# EAGLE design 2020can_master_v4_x (EAGLE 9.6.2)
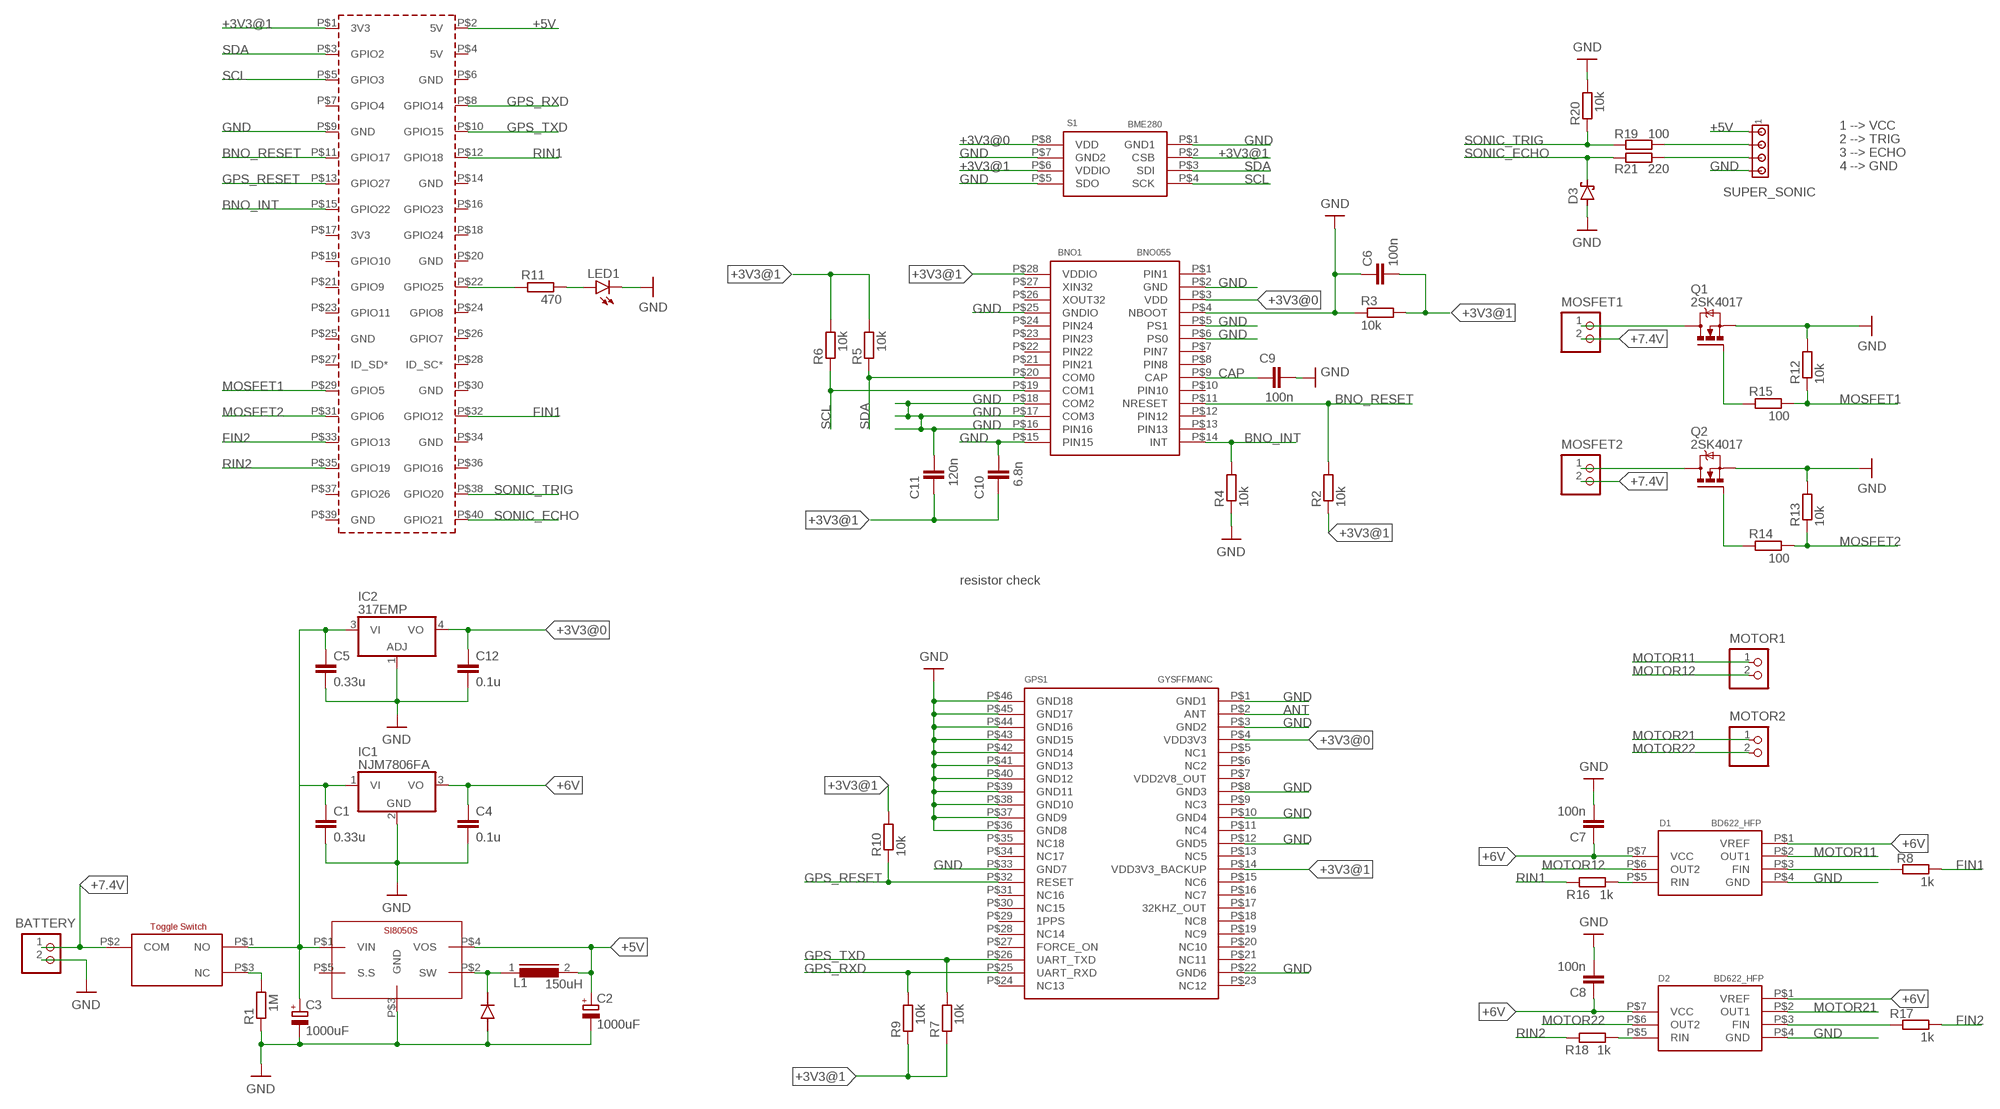
[diagram p0: schematic, sheet 1]

## Parts
BATTERY  B2P-VH  [B2P-VH]
BNO1  BNO055  [BNO055]
C1  0.33u  C5/3  [C5B3]
C2  1000uF  CPOL-EUE5-10.5  [E5-10,5]
C3  1000uF  CPOL-EUE5-10.5  [E5-10,5]
C4  0.1u  C5/3  [C5B3]
C5  0.33u  C5/3  [C5B3]
C6  100n  C-EUC1206  [C1206]
C7  100n  C-EUC1206  [C1206]
C8  100n  C-EUC1206  [C1206]
C9  100n  C-EUC1206  [C1206]
C10  6.8n  C-EUC1206  [C1206]
C11  120n  C-EUC1206  [C1206]
C12  0.1u  C5/3  [C5B3]
D1  BD622_HFP  [BD62**_HRP7]
D2  BD622_HFP  [BD62**_HRP7]
D3  15KEXXD  [DO201T15]
DIODE_1.1  DIODE_1.5  [DIODE_1.5]
GPS1  GYSFFMANC  [GYSFFMANC]
IC1  NJM7806FA  786TV  [TO220V]
IC2  317EMP  [SOT223]
L1  150uH  SFT830D  [SFT830D]
LED1  LED5MM  [LED5MM]
MOSFET1  B2P-VH  [B2P-VH]
MOSFET2  B2P-VH  [B2P-VH]
MOTOR1  B2P-VH  [B2P-VH]
MOTOR2  B2P-VH  [B2P-VH]
PCB1  RPI3RPI3  [RPI3]
Q1  2SK4017  IRF520  [TO220BV]
Q2  2SK4017  IRF520  [TO220BV]
R1  1M  R-EU_R1206  [R1206]
R2  10k  R-EU_R1206  [R1206]
R3  10k  R-EU_R1206  [R1206]
R4  10k  R-EU_R1206  [R1206]
R5  10k  R-EU_R1206  [R1206]
R6  10k  R-EU_R1206  [R1206]
R7  10k  R-EU_R1206  [R1206]
R8  1k  R-EU_R1206  [R1206]
R9  10k  R-EU_R1206  [R1206]
R10  10k  R-EU_R1206  [R1206]
R11  470  R-EU_0207/10  [0207/10]
R12  10k  R-EU_R1206  [R1206]
R13  10k  R-EU_R1206  [R1206]
R14  100  R-EU_0207/10  [0207/10]
R15  100  R-EU_0207/10  [0207/10]
R16  1k  R-EU_R1206  [R1206]
R17  1k  R-EU_R1206  [R1206]
R18  1k  R-EU_R1206  [R1206]
R19  100  R-EU_0207/10  [0207/10]
R20  10k  R-EU_R1206  [R1206]
R21  220  R-EU_0207/10  [0207/10]
S1  BME280  [BME280]
SI8050S1  SI8050S  [SI8050S]
SUPER_SONIC  MTA04-100  [10X04MTA]
SWITCH_2MS1T2B4M2QES1  SWITCH_2MS1T2B4M2QES  [SWITCH_2MS1T2B4M2QES]

## Nets
+3V3@0: BNO1.P$3(VDD) C12.1 GPS1.P$4(VDD3V3) IC2.4(VO) S1.P$8(VDD)
+3V3@1: BNO1.P$28(VDDIO) C6.2 C10.1 C11.1 GPS1.P$14(VDD3V3_BACKUP) PCB1.P$1(3V3) R2.1 R3.2 R5.2 R6.2 R7.1 R9.1 R10.2 S1.P$2(CSB) S1.P$6(VDDIO)
+5V [power]: C2.+ L1.2 PCB1.P$2(5V) SI8050S1.P$4(VOS) SUPER_SONIC.1
+6V [motor]: C4.1 C7.1 C8.1 D1.P$1(VREF) D1.P$7(VCC) D2.P$1(VREF) D2.P$7(VCC) IC1.3(VO)
+7.4V [power]: BATTERY.1 MOSFET1.2 MOSFET2.2 SWITCH_2MS1T2B4M2QES1.P$2(COM)
ANT [signal]: GPS1.P$2(ANT)
BNO_INT [signal]: BNO1.P$14(INT) PCB1.P$15(GPIO22) R4.2
BNO_RESET [signal]: BNO1.P$11(NRESET) PCB1.P$11(GPIO17) R2.2
CAP [signal]: BNO1.P$9(CAP) C9.1
FIN1 [signal]: PCB1.P$32(GPIO12) R8.1
FIN2 [signal]: PCB1.P$33(GPIO13) R17.1
GND: BATTERY.2 BNO1.P$2(GND) BNO1.P$4(NBOOT) BNO1.P$5(PS1) BNO1.P$6(PS0) BNO1.P$15(PIN15) BNO1.P$16(PIN16) BNO1.P$17(COM3) BNO1.P$18(COM2) BNO1.P$25(GNDIO) C1.2 C2.- C3.- C4.2 C5.2 C6.1 C7.2 C8.2 C9.2 C10.2 C11.2 C12.2 D1.P$4(GND) D2.P$4(GND) D3.A DIODE_1.1.P$1(ANODE) GPS1.P$1(GND1) GPS1.P$3(GND2) GPS1.P$8(GND3) GPS1.P$10(GND4) GPS1.P$12(GND5) GPS1.P$22(GND6) GPS1.P$33(GND7) GPS1.P$36(GND8) GPS1.P$37(GND9) GPS1.P$38(GND10) GPS1.P$39(GND11) GPS1.P$40(GND12) GPS1.P$41(GND13) GPS1.P$42(GND14) GPS1.P$43(GND15) GPS1.P$44(GND16) GPS1.P$45(GND17) GPS1.P$46(GND18) IC1.2(GND) IC2.1(ADJ) LED1.K(C) PCB1.P$9(GND) Q1.S Q2.S R1.1 R3.1 R4.1 R12.2 R13.2 R20.2 S1.P$1(GND1) S1.P$5(SDO) S1.P$7(GND2) SI8050S1.P$3(GND) SUPER_SONIC.4
GPS_RESET [signal]: GPS1.P$32(RESET) PCB1.P$13(GPIO27) R10.1
GPS_RXD [signal]: GPS1.P$25(UART_RXD) PCB1.P$8(GPIO14) R9.2
GPS_TXD [signal]: GPS1.P$26(UART_TXD) PCB1.P$10(GPIO15) R7.2
MOSFET1: PCB1.P$29(GPIO5) R12.1 R15.2
MOSFET2: PCB1.P$31(GPIO6) R13.1 R14.2
MOTOR11 [motor]: D1.P$2(OUT1) MOTOR1.1
MOTOR12 [motor]: D1.P$6(OUT2) MOTOR1.2
MOTOR21 [motor]: D2.P$2(OUT1) MOTOR2.1
MOTOR22 [motor]: D2.P$6(OUT2) MOTOR2.2
N$1: R1.2 SWITCH_2MS1T2B4M2QES1.P$3(NC)
N$2 [motor]: DIODE_1.1.P$2(CATHODE) L1.1 SI8050S1.P$2(SW)
N$3: PCB1.P$22(GPIO25) R11.1
N$4 [power]: C1.1 C3.+ C5.1 IC1.1(VI) IC2.3(VI) SI8050S1.P$1(VIN) SWITCH_2MS1T2B4M2QES1.P$1(NO)
N$5: LED1.A R11.2
N$6: MOSFET1.1 Q1.D
N$7: D1.P$3(FIN) R8.2
N$8: MOSFET2.1 Q2.D
N$9: D1.P$5(RIN) R16.1
N$10: Q1.G R15.1
N$11: Q2.G R14.1
N$12: D2.P$3(FIN) R17.2
N$14: D2.P$5(RIN) R18.1
N$15: R19.2 SUPER_SONIC.2
N$16: R21.2 SUPER_SONIC.3
RIN1 [signal]: PCB1.P$12(GPIO18) R16.2
RIN2 [signal]: PCB1.P$35(GPIO19) R18.2
SCL [signal]: BNO1.P$19(COM1) PCB1.P$5(GPIO3) R6.1 S1.P$4(SCK)
SDA [signal]: BNO1.P$20(COM0) PCB1.P$3(GPIO2) R5.1 S1.P$3(SDI)
SONIC_ECHO: D3.C PCB1.P$40(GPIO21) R21.1
SONIC_TRIG: PCB1.P$38(GPIO20) R19.1 R20.1
Unconnected: BNO1.P$1(PIN1) BNO1.P$7(PIN7) BNO1.P$8(PIN8) BNO1.P$10(PIN10) BNO1.P$12(PIN12) BNO1.P$13(PIN13) BNO1.P$21(PIN21) BNO1.P$22(PIN22) BNO1.P$23(PIN23) BNO1.P$24(PIN24) BNO1.P$26(XOUT32) BNO1.P$27(XIN32) GPS1.P$5(NC1) GPS1.P$6(NC2) GPS1.P$7(VDD2V8_OUT) GPS1.P$9(NC3) GPS1.P$11(NC4) GPS1.P$13(NC5) GPS1.P$15(NC6) GPS1.P$16(NC7) GPS1.P$17(32KHZ_OUT) GPS1.P$18(NC8) GPS1.P$19(NC9) GPS1.P$20(NC10) GPS1.P$21(NC11) GPS1.P$23(NC12) GPS1.P$24(NC13) GPS1.P$27(FORCE_ON) GPS1.P$28(NC14) GPS1.P$29(1PPS) GPS1.P$30(NC15) GPS1.P$31(NC16) GPS1.P$34(NC17) GPS1.P$35(NC18) PCB1.P$4(5V) PCB1.P$6(GND) PCB1.P$7(GPIO4) PCB1.P$14(GND) PCB1.P$16(GPIO23) PCB1.P$17(3V3) PCB1.P$18(GPIO24) PCB1.P$19(GPIO10) PCB1.P$20(GND) PCB1.P$21(GPIO9) PCB1.P$23(GPIO11) PCB1.P$24(GPIO8) PCB1.P$25(GND) PCB1.P$26(GPIO7) PCB1.P$27(ID_SD*) PCB1.P$28(ID_SC*) PCB1.P$30(GND) PCB1.P$34(GND) PCB1.P$36(GPIO16) PCB1.P$37(GPIO26) PCB1.P$39(GND) SI8050S1.P$5(S.S)

## Notes on the sheet
- 1 --> VCC
  2 --> TRIG
  3 --> ECHO
  4 --> GND
- resistor check

## Library data of the parts
BATTERY MOSFET1 MOSFET2 MOTOR1 MOTOR2 = CONN_VH:B2P-VH: Wire-to-Board 3.96mm pitch top mount connector Source: http://www.jst-mfg.com/product/pdf/jpn/VH.pdf http://www.jst-mfg.com/product/detail.php?series=262
BNO1 = BNO055:BNO055
C1 C4 C5 C12 = capacitor-wima:C: CAPACITOR naming: grid - package width
C2 C3 = resistor:CPOL-EU: POLARIZED CAPACITOR, European symbol
C6-C11 = rcl:C-EU: CAPACITOR, European symbol; SPICEPREFIX: C
D1 D2 = BD62_:BD622*_HFP
D3 = diode:15KEXXD: DIODE
DIODE_1.1 = diode_1.5mm:DIODE_1.5
GPS1 = GPS:GYSFFMANC
IC1 = linear:78*: Positive VOLTAGE REGULATOR Source: http://cache.national.com/ds/LM/LM78L05.pdf http://www.fairchildsemi.com/ds/LM/LM7805.pdf
IC2 = linear:*317: Positive VOLTAGE REGULATOR
L1 = inductors:SFT830D: INDUCTOR; SPICEPREFIX: L
LED1 = led:LED: LED OSRAM: - CHIPLED LG R971, LG N971, LY N971, LG Q971, LY Q971, LO R971, LY R971 LH N974, LH R974 LS Q976, LO Q976, LY Q976 LO Q996 - Hyper CHIPLED LW Q18S LB Q993, LB Q99A, LB R99A - SideLED LS A670, LO A670, LY A670, LG A670, LP A670 LB A673, LV A673, LT A673, LW A673 LH A674 LY A675 LS A676, LA A676, LO A676, LY A676, LW A676 LS A679, LY A679, LG A679 - Hyper Micro SIDELED® LS Y876, LA Y876, LO Y876, LY Y876 LT Y87S - SmartLED LW L88C, LW L88S LB L89C, LB L89S, LG L890 LS L89K, LO L89K, LY L89K LS L896, LA L896, LO L896, LY L896 - TOPLED LS T670, LO T670, LY T670, LG T670, LP T670 LSG T670, LSP T670, LSY T670, LOP T670, LYG T670 LG T671, LOG T671, LSG T671 LB T673, LV T673, LT T673, LW T673 LH T674 LS T676, LA T676, LO T676, LY T676, LB T676, LH T676, LSB T676, LW T676 LB T67C, LV T67C, LT T67C, LS T67K, LO T67K, LY T67K, LW E67C LS E67B, LA E67B, LO E67B, LY E67B, LB E67C, LV E67C, LT E67C LW T67C LS T679, LY T679, LG T679 LS T770, LO T770, LY T770, LG T770, LP T770 LB T773, LV T773, LT T773, LW T773 LH T774 LS E675, LA E675, LY E675, LS T675 LS T776, LA T776, LO T776, LY T776, LB T776 LHGB T686 LT T68C, LB T68C - Hyper Mini TOPLED® LB M676 - Mini TOPLED Santana® LG M470 LS M47K, LO M47K, LY M47K Source: http://www.osram.convergy.de LUXEON: - LUMILED® LXK2-PW12-R00, LXK2-PW12-S00, LXK2-PW14-U00, LXK2-PW14-V00 LXK2-PM12-R00, LXK2-PM12-S00, LXK2-PM14-U00 LXK2-PE12-Q00, LXK2-PE12-R00, LXK2-PE12-S00, LXK2-PE14-T00, LXK2-PE14-U00 LXK2-PB12-K00, LXK2-PB12-L00, LXK2-PB12-M00, LXK2-PB14-N00, LXK2-PB14-P00, LXK2-PB14-Q00 LXK2-PR12-L00, LXK2-PR12-M00, LXK2-PR14-Q00, LXK2-PR14-R00 LXK2-PD12-Q00, LXK2-PD12-R00, LXK2-PD12-S00 LXK2-PH12-R00, LXK2-PH12-S00 LXK2-PL12-P00, LXK2-PL12-Q00, LXK2-PL12-R00 Source: www.luxeon.com KINGBRIGHT: KA-3528ASYC Source: www.kingbright.com
PCB1 = Raspberry Pi 3 model B:RPI3: Device for Raspberry Pi 3 board created by Dave Young for www.element14.com More information and support community is available at https://www.element14.com/community/community/raspberry-pi Device for Raspberry Pi 3 board updated by Gerald Schwarz for www.element14.com On RPI3 addet the layer milling and created a mirrored shield.
Q1 Q2 = transistor-power:IRF520: HEXFET Power MOSFET
R1-R21 = rcl:R-EU_: RESISTOR, European symbol; SPICEPREFIX: R
S1 = BME280:BME280
SI8050S1 = SI-8050S:SI8050S
SUPER_SONIC = con-amp:MTA04-100: AMP connector
SWITCH_2MS1T2B4M2QES1 = switch_2MS1T2B4M2QES:SWITCH_2MS1T2B4M2QES

## Net classes
0 default: width 0.2 mm, clearance 0.05 mm
1 power: width 1.5 mm, clearance 0.2 mm
2 mos: width 1.5 mm, clearance 0.2 mm
3 signal: width 0.2 mm, clearance 0.05 mm
4 motor: width 0.8 mm, clearance 0.1 mm

## Board
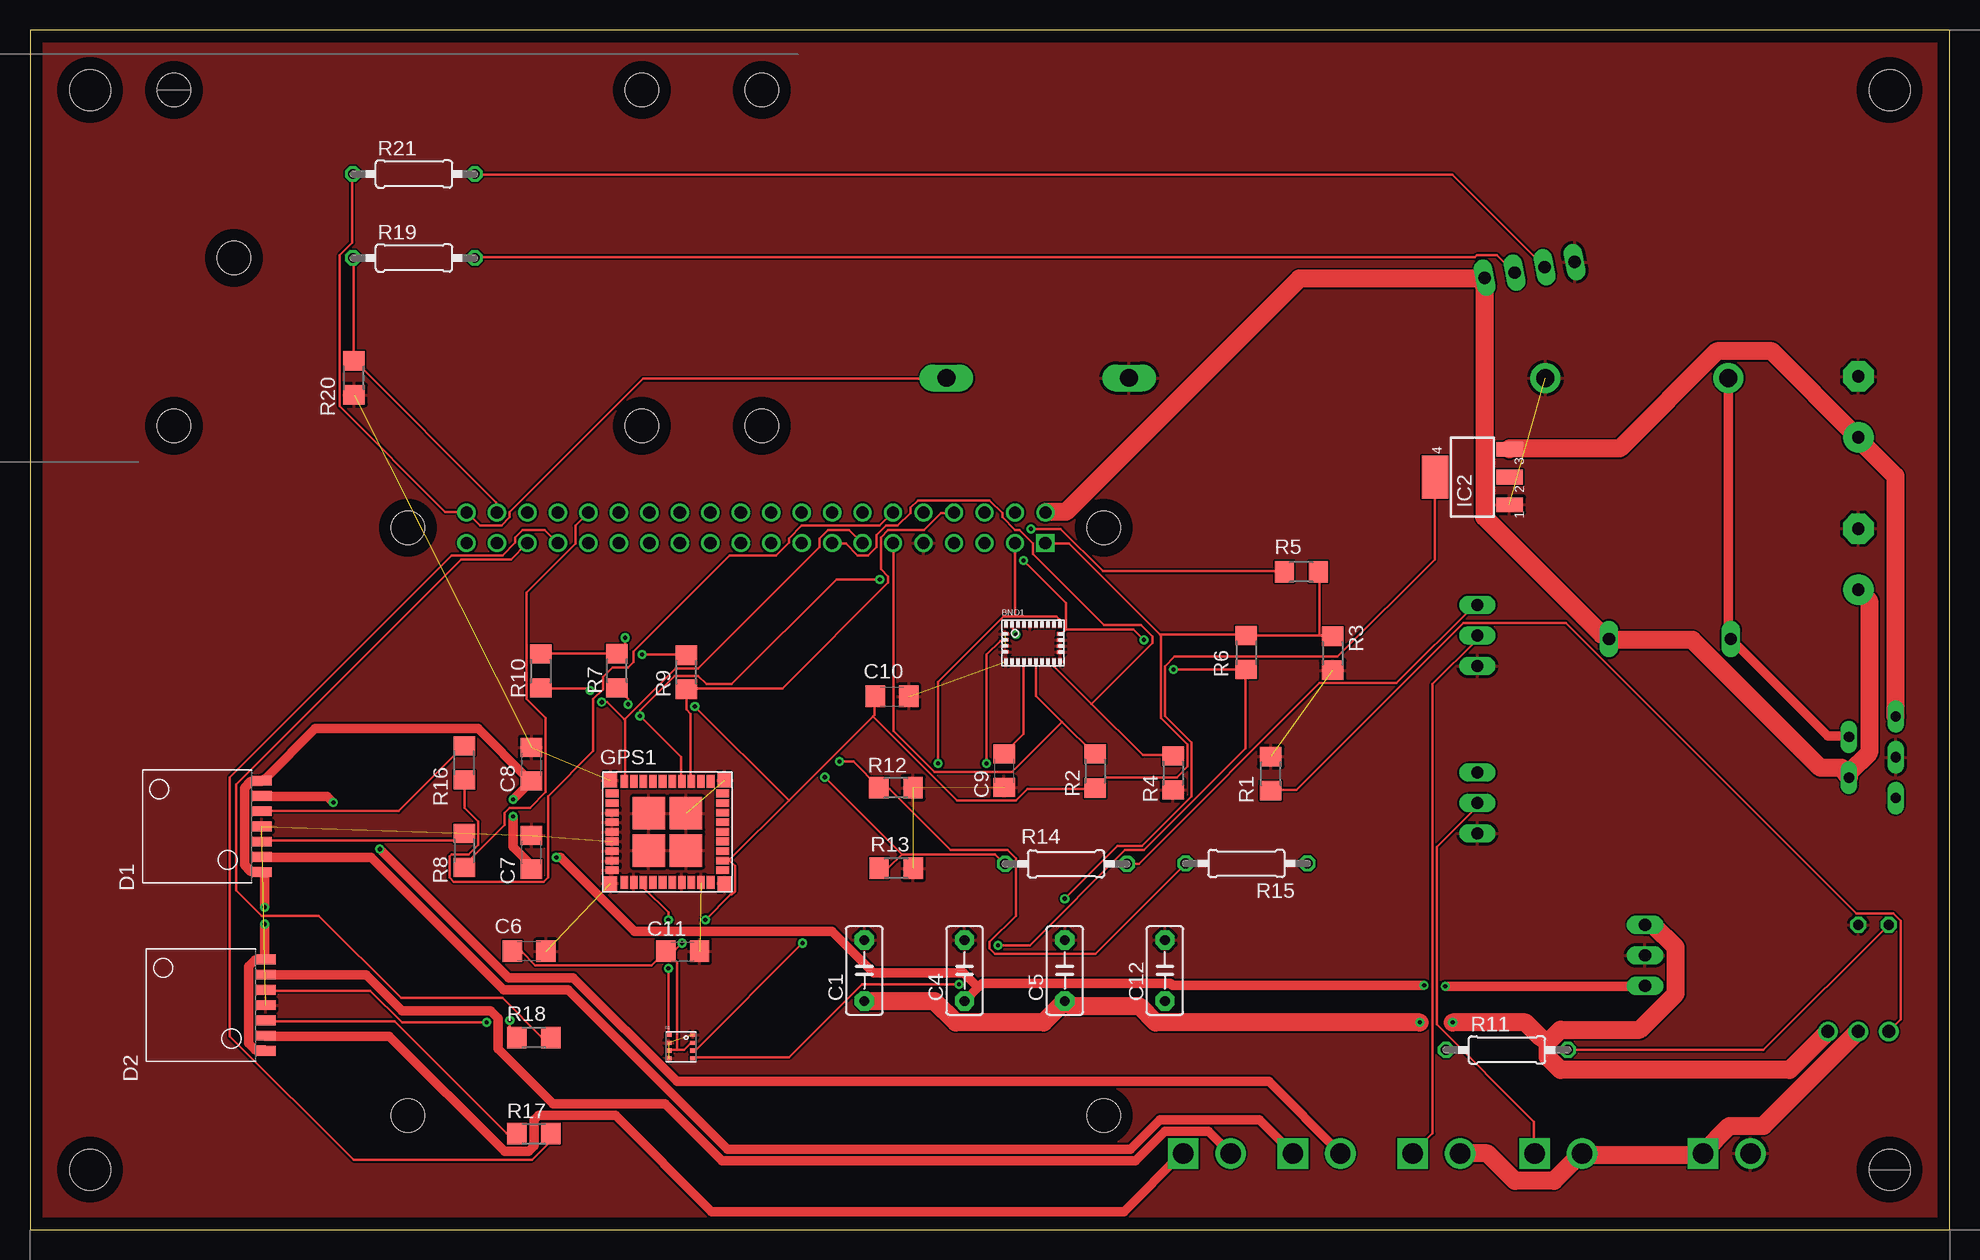
[diagram p1: board, top side]
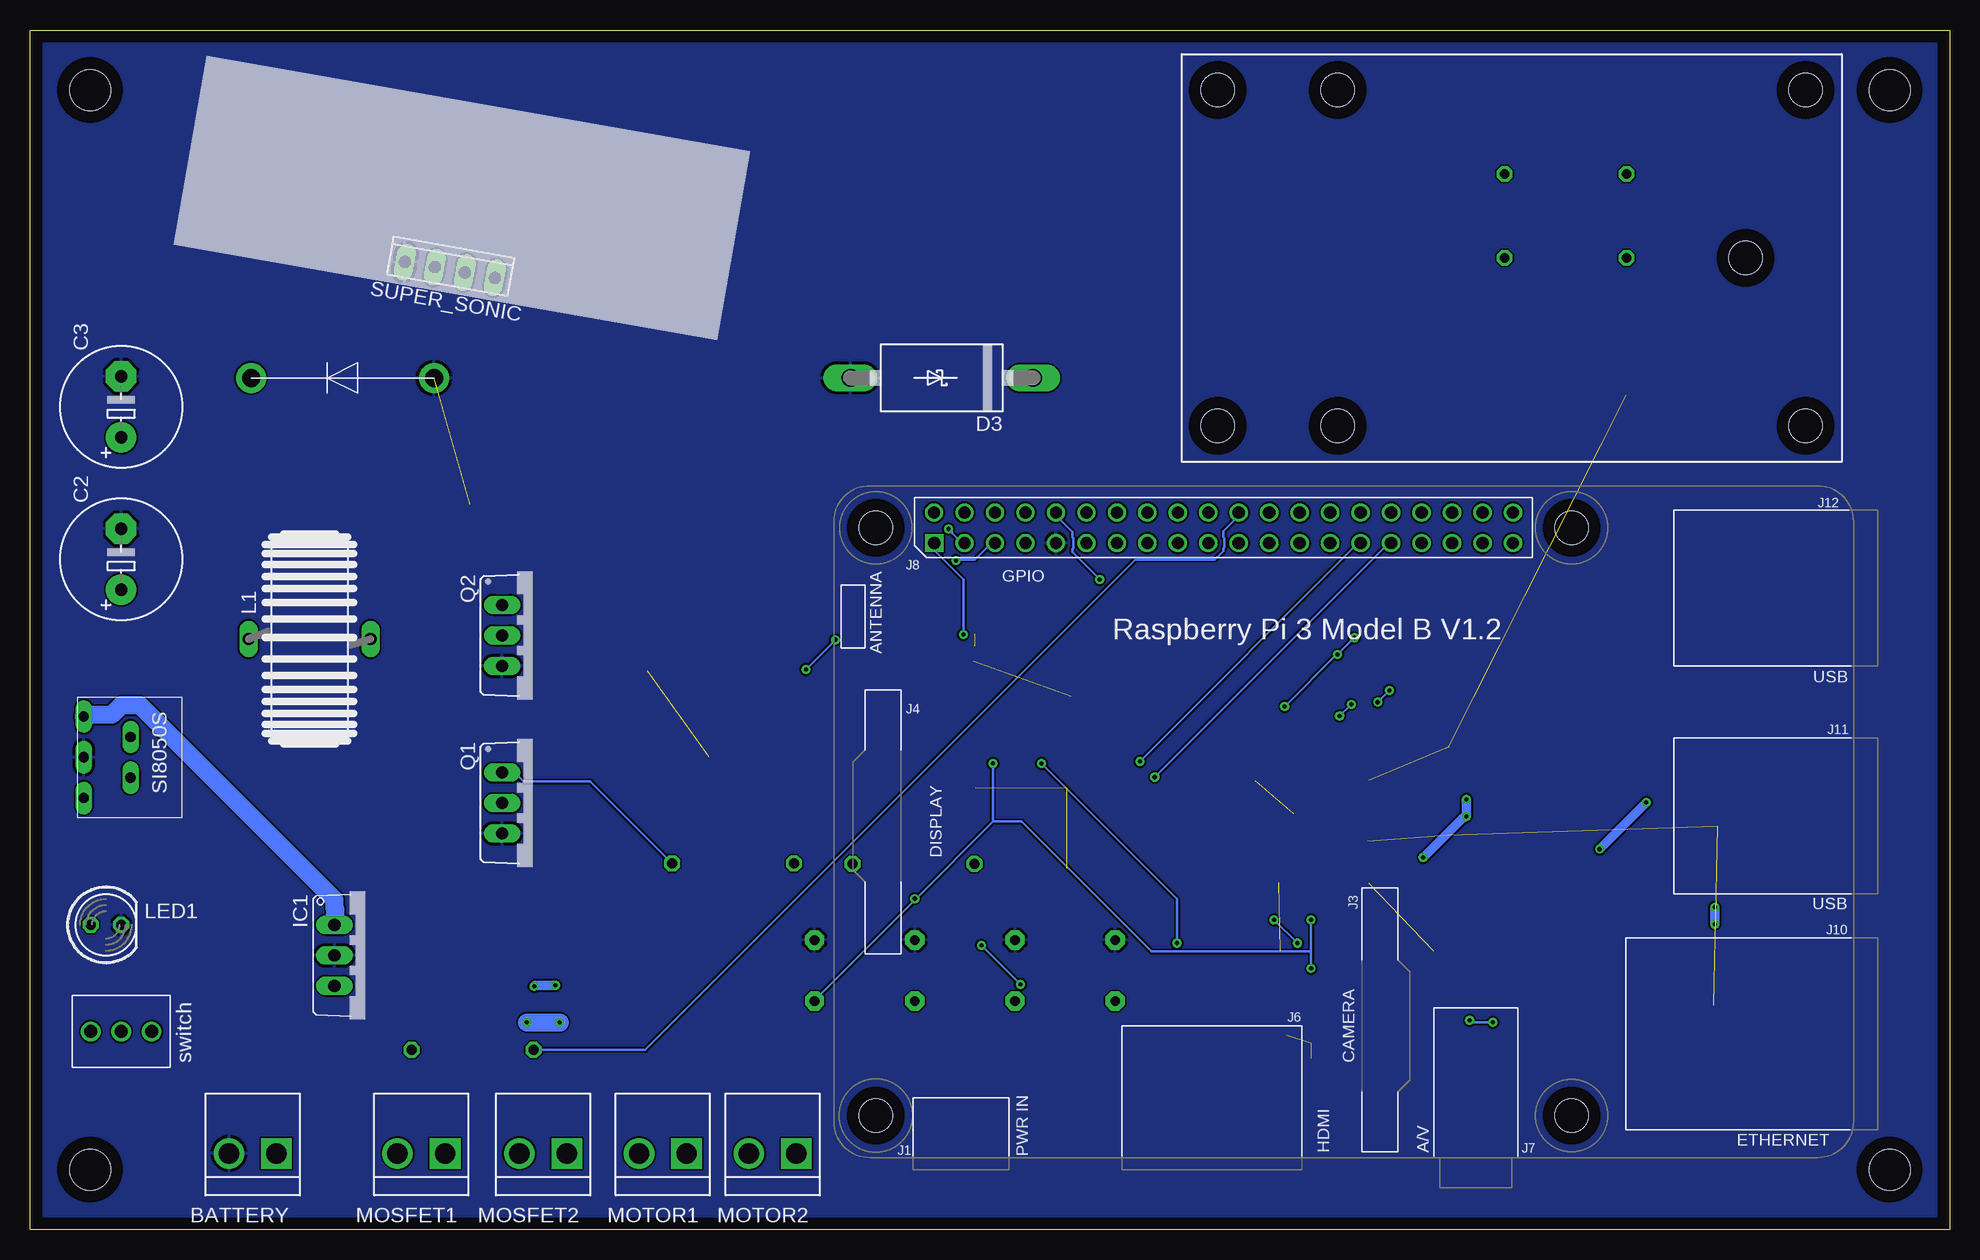
[diagram p2: board, bottom side, seen from below]

Size 160 x 100 mm. Coordinates in mm from the lower left corner, seen from the top.
Outline: 0,0 160,0 160,100 0,100 0,0
Copper layers (1*16): Top 0.035mm / dielectric 1.5mm / Bottom 0.035mm
Design rules "default": minimum track width 6mil, minimum drill 0.35mm, track to track 6mil, track to pad 6mil, pad to pad 6mil, via to via 6mil, smd to smd 6mil, copper to edge 40mil, drill to drill 6mil, minimum pad ring 10mil, minimum via ring 8mil, stop-mask expansion 4mil, vias tented up to drill 0mil, thermal gap 10mil
Holes 3.4 mm at 5,5 5,95 155,5 155,95
Holes 2.8 mm at 12,67 12,95 51,95 61,95 61,67 51,67 17,81

### Footprints (pad centres in the part's own frame; a part is rotated, then mirrored left to right if it is on the bottom)
B2P-VH = drill 1.7 square: 1 -1.98,0 | drill 1.7: 2 1.98,0
BNO055 = smd 0.305 x 0.61: P$1 0.35,3.47; P$6 0.355,0.35; P$7 0.855,0.35; P$8 1.355,0.35; P$9 1.855,0.35; P$10 2.355,0.35; P$11 2.855,0.35; P$12 3.355,0.35; P$13 3.855,0.35; P$14 4.355,0.35; P$15 4.855,0.35; P$20 4.85,3.47; P$21 4.35,3.47; P$22 3.85,3.47; P$23 3.35,3.47; P$24 2.85,3.47; P$25 2.35,3.47; P$26 1.85,3.47; P$27 1.35,3.47; P$28 0.85,3.47 | smd 0.61 x 0.305: P$2 0.275,2.655; P$3 0.275,2.155; P$4 0.275,1.655; P$5 0.275,1.155; P$16 4.915,1.15; P$17 4.915,1.65; P$18 4.915,2.15; P$19 4.915,2.65
C5B3 = drill 0.813 pad 1.6 octagon: 1 -2.54,0; 2 2.54,0
E5-10,5 = drill 1.016 pad 2.54: + -2.54,0 | drill 1.016 pad 2.54 octagon: - 2.54,0
C1206 = smd 1.6 x 1.8: 1 -1.4,0; 2 1.4,0
BD62**_HRP7 = smd 0.813 x 1.676: P$1 0.887,-0.835; P$2 2.158,-0.835; P$3 3.428,-0.835; P$4 4.697,-0.835; P$5 5.968,-0.835; P$6 7.237,-0.835; P$7 8.508,-0.835
DO201T15 = drill 1.499 long: A 7.62,0; C -7.62,0
DIODE_1.5 = drill 1.5 pad 2.5: P$1 -7.62,0; P$2 7.62,0
GYSFFMANC = smd 1.2 x 1.1: P$1 0.7,10.15; P$12 0.7,0.65; P$22 9.3,0.65; P$33 9.3,10.15 | smd 1.1 x 0.635: P$2 0.8,9; P$3 0.8,8.2; P$4 0.8,7.4; P$5 0.8,6.6; P$6 0.8,5.8; P$7 0.8,5; P$8 0.8,4.2; P$9 0.8,3.4; P$10 0.8,2.6; P$11 0.8,1.8; P$23 9.2,1.8; P$24 9.2,2.6; P$25 9.2,3.4; P$26 9.2,4.2; P$27 9.2,5; P$28 9.2,5.8; P$29 9.2,6.6; P$30 9.2,7.4; P$31 9.2,8.2; P$32 9.2,9 | smd 0.635 x 1.1: P$13 1.8,0.8; P$14 2.6,0.8; P$15 3.4,0.8; P$16 4.2,0.8; P$17 5,0.8; P$18 5.8,0.8; P$19 6.6,0.8; P$20 7.4,0.8; P$21 8.2,0.8; P$34 8.2,10; P$35 7.4,10; P$36 6.6,10; P$37 5.8,10; P$38 5,10; P$39 4.2,10; P$40 3.4,10; P$41 2.6,10; P$42 1.8,10 | smd 2.7 x 2.7: P$43 3.45,6.95; P$44 3.45,3.85; P$45 6.55,3.85; P$46 6.55,6.95
TO220V = drill 1.016 long: 1 -2.54,-2.54; 2 0,-2.54; 3 2.54,-2.54
SOT223 = smd 1.219 x 2.235: 1 -2.311,-3.099; 2 0,-3.099; 3 2.311,-3.099 | smd 3.6 x 2.2: 4 0,3.099
SFT830D = drill 1.016 long: 1 -5.08,0; 2 5.08,0
LED5MM = drill 0.813 octagon: A -1.27,0; K 1.27,0
RPI3 = drill 1.016 square: P$1 8.37,51.23 | drill 1.016: P$2 8.357,53.772; P$3 10.897,51.232; P$4 10.897,53.772; P$5 13.437,51.232; P$6 13.437,53.772; P$7 15.977,51.232; P$8 15.977,53.772; P$9 18.517,51.232; P$10 18.517,53.772; P$11 21.057,51.232; P$12 21.057,53.772; P$13 23.597,51.232; P$14 23.597,53.772; P$15 26.137,51.232; P$16 26.137,53.772; P$17 28.677,51.232; P$18 28.677,53.772; P$19 31.217,51.232; P$20 31.217,53.772; P$21 33.757,51.232; P$22 33.757,53.772; P$23 36.297,51.232; P$24 36.297,53.772; P$25 38.837,51.232; P$26 38.837,53.772; P$27 41.377,51.232; P$28 41.377,53.772; P$29 43.917,51.232; P$30 43.917,53.772; P$31 46.457,51.232; P$32 46.457,53.772; P$33 48.997,51.232; P$34 48.997,53.772; P$35 51.537,51.232; P$36 51.537,53.772; P$37 54.077,51.232; P$38 54.077,53.772; P$39 56.617,51.232; P$40 56.617,53.772 | hole 2.75: 3.5,3.5; 61.5,3.5; 3.5,52.5; 61.5,52.5
TO220BV = drill 1.016 long: D 0,-2.54; G -2.54,-2.54; S 2.54,-2.54
R1206 = smd 1.6 x 1.803: 1 -1.422,0; 2 1.422,0
0207/10 = drill 0.813 octagon: 1 -5.08,0; 2 5.08,0
BME280 = smd 0.5 x 0.35: P$1 2.275,2.225; P$2 2.275,1.575; P$3 2.275,0.925; P$4 2.275,0.275; P$5 0.225,0.275; P$6 0.225,0.925; P$7 0.225,1.575; P$8 0.225,2.225
SI8050S = drill 0.85 pad 0.9 long: P$1 -3.4,-8.2; P$2 -1.7,-4.3; P$3 0,-8.2; P$4 1.7,-4.3; P$5 3.4,-8.2
10X04MTA = drill 1.016 long: 1 3.81,0; 2 1.27,0; 3 -1.27,0; 4 -3.81,0
SWITCH_2MS1T2B4M2QES = drill 1.09: P$1 0,2.54; P$2 0,0; P$3 0,-2.54

### Placement (x,y rotation side)
BATTERY  141.43,6.35 180 bottom
BNO1  81,47 0 top
C1  69.55,21.59 90 top
C2  152.4,55.88 90 bottom
C3  152.4,68.58 90 bottom
C4  77.9,21.59 90 top
C5  86.25,21.59 90 top
C6  41.6,23.2 180 top
C7  41.8,31.45 90 top
C8  41.8,38.8 90 top
C9  81.2,38.25 270 top
C10  71.85,44.45 0 top
C11  54.4,23.2 0 top
C12  94.6,21.59 90 top
D1  18.48,28.91 90 top
D2  18.8,14.01 90 top
D3  84,71 180 bottom
DIODE_1.1  133.95,70.99 180 bottom
GPS1  58.53,28.15 90 top
IC1  132.08,22.86 270 bottom
IC2  120.23,62.73 90 top
L1  136.7,49.23 0 bottom
LED1  153.67,25.4 0 bottom
MOSFET1  127.38,6.35 180 bottom
MOSFET2  117.22,6.35 180 bottom
MOTOR1  107.25,6.35 180 bottom
MOTOR2  98.09,6.35 180 bottom
PCB1  93,6 0 bottom
Q1  118.11,35.56 270 bottom
Q2  118.11,49.53 270 bottom
R1  103.42,38 270 top
R2  88.78,38.22 90 top
R3  108.58,48.04 90 top
R4  95.28,38.06 90 top
R5  105.98,54.82 0 top
R6  101.38,48.1 90 top
R7  48.92,46.58 270 top
R8  36.2,31.6 90 top
R9  54.72,46.46 270 top
R10  42.58,46.56 90 top
R11  123.11,14.97 0 top
R12  72.18,36.82 0 top
R13  72.2,30.12 0 top
R14  86.36,30.48 180 top
R15  101.4,30.52 180 top
R16  36.2,38.9 270 top
R17  42,8 180 top
R18  42,16 0 top
R19  32,81 0 top
R20  27,71 270 top
R21  32,88 0 top
S1  53,14 0 top
SI8050S1  147.32,39.37 270 bottom
SUPER_SONIC  125,80 350 bottom
SWITCH_2MS1T2B4M2QES1  152.4,16.51 270 bottom

### Tracks (layer width: path | path; a pad name or v marks a point on that pad's centre or on a via)
+3V3@0  (via drill 0.35)
  Top 0.2: v53.21,21.76 53.21,16.3 S1.P$8 | v53.21,25.81 53.21,26.43 51.19,28.46 51.19,28.9 GPS1.P$4 | v79.73,38.85 79.73,47.93 80.88,49.07 81.23,49.07 BNO1.P$3 | v86.25,27.57 90.66,31.98 92.68,31.98 96.82,36.12 96.82,40.61 94.62,42.82 94.62,46.96 95.41,47.75 108.98,47.75 117.08,55.85 117.08,62.73 IC2.4
  Bottom 0.2: v53.21,25.81 53.21,23.17 | 53.21,23.17 v53.21,21.76 | 79.73,34.01 v79.73,38.85 | 86.21,27.53 94.62,19.12 C12.1 | 86.21,27.53 79.73,34.01 | v86.25,27.57 86.21,27.53 | 53.21,23.17 66.52,23.17 77.35,34.01 79.73,34.01
+3V3@1  (via drill 0.35)
  Top 0.2: v82.2,49.6 81.93,49.87 81.93,50.39 BNO1.P$28 | 107.48,49.51 108.54,49.51 R3.2 | 107.48,49.51 101.4,49.51 R6.2 101.31,49.6 94.27,49.6 | 107.48,49.51 107.48,54.8 R5.2 | 94.27,49.6 94.18,49.6 86.6,57.18 84.66,57.18 PCB1.P$1 | 53.92,14.98 54.53,14.98 55.06,15.51 55.24,15.51 S1.P$2 | 53.92,14.98 53.3,14.98 S1.P$6 | 53.92,14.98 53.92,22.29 53.04,23.17 C11.1 | C6.2 40.26,23.17 40.97,23.17 42.11,22.02 51.8,22.02 52.95,23.17 C11.1 | R10.2 42.64,48.01 48.9,48.01 R7.1 48.9,48.1 49.6,48.81 v49.6,49.34 | v51.01,47.93 54.71,47.93 R9.1 | 58.32,30.84 57.79,30.84 GPS1.P$14 | 70.26,42.77 70.39,42.91 70.39,44.4 C10.1 | 70.26,42.77 63.26,35.77 | 63.26,35.77 58.32,30.84 | 70.26,42.77 77.26,35.77 82.2,35.77 83.17,36.74 88.72,36.74 R2.1 88.81,36.83 89.69,37.71 95.59,37.71 96.47,38.59 96.47,40.44 94.27,42.64 94.27,49.6 | 63.26,35.77 v55.41,43.61 | v54.36,23.88 53.39,22.91 C11.1 | v56.3,25.81 58.41,27.93 58.5,27.93 58.76,28.19 58.76,30.31 58.32,30.75 58.32,30.84
  Bottom 0.2: v82.2,49.6 82.2,54.18 84.58,56.56 84.58,57.18 PCB1.P$1 | v49.6,49.34 v51.01,47.93 51.1,47.93 v55.41,43.61 | v56.3,25.81 v54.36,23.88
+5V
  Top 1.5: C2.+ 152.41,53.3 153.29,52.42 153.29,39.73 151.62,38.06 151.62,37.71 SI8050S1.P$4 151,38.5 149.24,38.5 138.58,49.16 131.62,49.16 L1.2 131,49.6 121.23,59.38 121.23,78.58 SUPER_SONIC.1 121.23,79.29 105.81,79.29 86.34,59.82 84.66,59.82 PCB1.P$2
+6V  (via drill 0.35)
  Top 0.8: v40.26,34.45 40.26,31.89 41.76,30.39 41.76,30.13 C7.1 | v40.26,35.86 41.76,37.35 C8.1 41.49,37.62 37.35,41.76 23.79,41.76 19.65,37.62 D1.P$7 19.29,37.35 18.41,37.35 17.88,36.83 17.88,30.39 18.41,29.87 19.29,29.87 D1.P$1 19.56,29.51 v19.56,26.87 | D2.P$1 19.56,14.98 18.77,14.98 18.24,15.51 18.24,21.94 18.77,22.46 19.56,22.46 D2.P$7 19.56,22.91 v19.56,25.46 | v117.97,20.26 134.62,20.26 IC1.3 | v116.2,20.35 95.24,20.35 95.06,20.53 79.38,20.53 79.03,20.18 | 79.03,20.18 77.97,19.12 C4.1 | v43.87,31.01 44.23,31.01 50.39,24.84 66.87,24.84 70.3,21.41 77.79,21.41 79.03,20.18
  Bottom 0.8: v40.26,35.86 v40.26,34.45 40.61,34.27 v43.87,31.01 | v19.56,26.87 v19.56,25.46 | v117.97,20.26 117.88,20.35 v116.2,20.35
+7.4V
  Top 1.5: MOSFET2.2 119.29,6.34 121.49,6.34 123.78,4.05 127.04,4.05 129.33,6.34 MOSFET1.2 130.04,6.17 138.76,6.17 BATTERY.1 139.46,6.43 141.66,8.63 144.48,8.63 152.32,16.48 SWITCH_2MS1T2B4M2QES1.P$2
BNO_INT
  Top 0.2: 88.5,43.83 92.77,39.56 95.24,39.56 R4.2 | 88.5,43.83 85.37,46.96 85.37,47.31 BNO1.P$14 | 88.5,43.83 93.56,48.9 93.56,49.42 92.59,50.39 89.51,50.39 83.61,56.3 83.61,57.18 82.46,58.32 82.11,58.32 81.05,59.38 81.05,59.73 80,60.79 74,60.79 73.39,60.17 73.39,59.73 72.33,58.67 71.36,58.67 70.57,57.88 70.57,56.91 69.86,56.21 68.98,56.21 68.01,57.18 66.87,57.18 PCB1.P$15
BNO_RESET
  Top 0.2: 86.03,42.33 88.72,39.65 R2.2 | 86.03,42.33 83.87,44.49 83.87,47.31 BNO1.P$11 | 86.03,42.33 81.84,38.15 75.41,38.15 71.98,41.58 71.98,57.18 PCB1.P$11
CAP
  Top 0.2: BNO1.P$9 82.81,47.31 82.81,41.32 81.23,39.73 C9.1
FIN1
  Top 0.2: R8.1 36.21,30.22 36.21,30.39 39.56,33.74 39.56,34.71 40,35.15 41.67,35.15 42.99,36.47 42.99,42.64 41.41,44.23 41.41,53.12 45.46,57.18 45.46,58.67 46.52,59.73 PCB1.P$32
FIN2
  Top 0.2: R17.1 43.34,7.93 43.34,7.31 41.85,5.82 26.96,5.82 16.65,16.12 16.65,37.71 35.15,56.21 39.38,56.21 40.44,57.27 40.44,57.71 41.05,58.32 42.91,58.32 43.96,57.27 PCB1.P$33
GND  (16 unrouted)
  pour Bottom: 0,0 160,0 160,100 0,100
  pour Top: 0,0 160,0 160,100 0,100
GPS_RESET  (via drill 0.35)
  Top 0.2: 49.6,42.55 49.6,37.35 GPS1.P$32 | 49.6,42.55 53.83,46.78 55.68,46.78 65.81,56.91 65.81,57.62 66.52,58.32 68.28,58.32 69.33,57.27 PCB1.P$13 | v46.69,44.93 46.52,45.11 42.64,45.11 R10.1 | v47.66,43.96 48.1,43.96 49.51,42.55 49.6,42.55
  Bottom 0.2: v47.66,43.96 v46.69,44.93
GPS_RXD
  Top 0.2: GPS1.P$25 55.06,37.35 55.06,42.99 54.71,43.34 54.71,45.02 R9.2 54.8,45.11 62.73,45.11 71.54,53.92 71.54,54.45 70.92,55.06 70.92,57.71 71.54,58.32 74.53,58.32 75.94,59.73 77,59.73 PCB1.P$8
GPS_TXD  (via drill 0.35)
  Top 0.2: v49.87,43.79 49.87,44.23 48.98,45.11 R7.2 | GPS1.P$26 54.27,37.35 54.27,39.38 v50.83,42.82 50.83,43.26 53.74,46.16 55.68,46.16 56.38,45.46 58.5,45.46 67.22,54.18 v70.83,54.18
  Bottom 0.2: v49.87,43.79 v50.83,42.82 | v70.83,54.18 73.12,56.47 73.12,56.74 73.03,56.83 73.03,57.62 73.12,57.71 73.12,58.15 74.44,59.47 74.44,59.73 PCB1.P$10
MOSFET1  (via drill 0.35)
  Top 0.2: R15.2 96.29,30.48 88.81,22.99 80.44,22.99 80,23.43 80,23.96 82.2,26.17 82.2,30.92 81.49,31.63 76.73,31.63 71.62,36.74 70.83,36.74 R12.1 70.74,36.91 68.63,39.03 v67.48,39.03
  Bottom 0.2: v67.48,39.03 49.34,57.18 49.16,57.18 PCB1.P$29
MOSFET2  (via drill 0.35)
  Top 0.2: 72.68,31.28 71.54,30.13 70.83,30.13 R13.1 | 72.68,31.28 80.44,31.28 81.23,30.48 R14.2 | 72.68,31.28 v66.25,37.71
  Bottom 0.2: v66.25,37.71 46.78,57.18 46.6,57.18 PCB1.P$31
MOTOR11
  Top 0.8: D1.P$2 19.38,31.01 28.46,31.01 39.47,20 44.84,20 58.15,6.7 91.71,6.7 94.18,9.16 102.46,9.16 105.19,6.43 MOTOR1.1
MOTOR12  (via drill 0.35)
  Top 0.8: v25.29,35.59 24.76,36.12 19.38,36.12 D1.P$6 | v29.16,31.72 39.91,20.97 45.28,20.97 53.92,12.33 103.25,12.33 109.16,6.43 MOTOR1.2
  Bottom 0.8: v29.16,31.72 v25.29,35.59
MOTOR21
  Top 0.8: D2.P$2 19.65,16.12 29.95,16.12 39.56,6.52 41.58,6.52 42.02,6.96 42.02,9.16 42.38,9.52 48.81,9.52 56.83,1.5 91.18,1.5 96.03,6.34 MOTOR2.1
MOTOR22
  Top 0.8: D2.P$6 19.65,21.23 28.02,21.23 31.01,18.24 38.41,18.24 39.03,17.62 39.03,15.06 43.61,10.48 52.95,10.48 57.71,5.73 92.15,5.73 94.62,8.19 98.23,8.19 99.99,6.43 MOTOR2.2
N$1
  Top 0.2: R1.2 103.43,36.65 105.54,36.65 119.46,50.57 128.01,50.57 152.24,26.34 155.32,26.34 155.94,25.73 155.94,17.53 154.97,16.56 SWITCH_2MS1T2B4M2QES1.P$3
N$2
  Top 0.8: SI8050S1.P$2 151.53,41.14 149.86,41.14 141.84,49.16 L1.1 141.58,49.51 141.58,70.92 DIODE_1.1.P$2
N$3
  Bottom 0.2: R11.1 117.97,14.98 108.72,14.98 67.84,55.85 61.23,55.85 60.52,56.56 60.52,56.83 60.44,56.91 60.44,57.62 60.52,57.71 60.52,58.23 59.29,59.47 59.29,59.73 PCB1.P$22
N$4  (via drill 0.35)
  Top 1.5: IC2.3 123.34,65.11 132.5,65.11 140.61,73.21 145.19,73.21 152.32,66.08 C3.+ 152.85,65.46 155.5,62.81 155.5,42.82 SI8050S1.P$1 | C1.1 69.6,19.03 75.41,19.03 77.18,17.27 84.49,17.27 86.25,19.03 C5.1 86.87,18.59 92.5,18.59 93.83,17.27 v115.85,17.27 | 126.51,15.59 127.57,16.65 134.18,16.65 137.17,19.65 137.17,23.52 135.32,25.37 134.71,25.37 IC1.1 | 126.51,15.59 126.51,14.36 127.57,13.3 146.69,13.3 149.86,16.48 SWITCH_2MS1T2B4M2QES1.P$1 | v118.58,17.27 124.66,17.27 125.89,16.03 126.51,15.59
  Bottom 1.5: v118.58,17.27 v115.85,17.27 | SI8050S1.P$1 155.5,42.82 155.06,42.82 154.97,42.91 153.21,42.91 152.41,43.7 150.83,43.7 134.62,27.49 134.62,26.78 134.53,26.69 134.53,26.17 134.62,26.08 134.62,25.46 IC1.1
N$5
  Top 0.2: R11.2 128.27,14.98 144.48,14.98 154.88,25.37 LED1.A
N$6
  Top 0.2: Q1.D 120.61,35.5 120.61,35.24 117.26,31.89 117.26,17.09 125.37,8.99 125.37,6.43 MOSFET1.1
N$7
  Top 0.2: D1.P$3 19.38,32.42 35.59,32.42 36.12,32.95 R8.2
N$8
  Top 0.2: Q2.D 120.61,49.51 120.61,49.16 116.91,45.46 116.91,8.02 115.32,6.43 MOSFET2.1
N$9
  Top 0.2: D1.P$5 19.38,34.89 30.75,34.89 36.12,40.26 R16.1
N$10
  Bottom 0.2: R15.1 106.51,30.57 113.3,37.35 118.85,37.35 119.55,38.06 120.61,38.06 Q1.G
N$11
  Top 0.2: R14.1 92.42,30.48 107.48,45.55 113.91,45.55 120.43,52.07 120.61,52.07 Q2.G
N$12
  Top 0.2: D2.P$3 19.65,17.36 30.39,17.36 39.73,8.02 40.53,8.02 R17.2
N$14  (via drill 0.35)
  Top 0.2: v38.06,17.27 31.01,17.27 28.37,19.91 19.65,19.91 D2.P$5 | v40,17.44 40,16.56 40.53,16.03 R18.1
  Bottom 0.2: v38.06,17.27 39.82,17.27 v40,17.44
N$15
  Top 0.2: R19.2 37.09,81.05 120.43,81.05 120.61,81.23 122.28,81.23 123.69,79.82 SUPER_SONIC.2
N$16
  Top 0.2: R21.2 37.09,87.92 118.58,87.92 126.25,80.26 SUPER_SONIC.3
RIN1
  Top 0.2: R16.2 36.21,37.44 36.21,35.15 37.35,34.01 37.35,32.07 36.56,31.28 35.15,31.28 34.98,31.1 34.98,29.34 35.33,28.98 42.82,28.98 43.17,29.34 43.17,36.12 46.96,39.91 46.96,44.23 47.75,45.02 47.75,46.08 48.54,46.87 49.87,46.87 50.3,47.31 50.3,48.19 58.32,56.21 62.2,56.21 63.26,57.27 63.26,57.62 64.31,58.67 70.83,58.67 71.89,59.73 PCB1.P$12
RIN2
  Top 0.2: R18.2 43.34,16.03 42.64,16.03 39.38,19.29 30.92,19.29 24.05,26.17 19.29,26.17 17.18,28.28 17.18,37.09 35.95,55.85 40.09,55.85 41.41,57.18 PCB1.P$35
SCL  (via drill 0.35)
  Top 0.2: 86.34,50.04 85.99,49.69 BNO1.P$19 | 86.34,50.04 86.34,52.24 v82.81,55.77 | v77.44,20.44 69.33,20.44 63.26,14.36 55.33,14.36 S1.P$4 | v80.7,23.7 83.34,23.7 91.27,31.63 92.86,31.63 101.31,40.09 101.31,46.6 R6.1 101.31,46.69 v95.32,46.69 | 86.34,50.04 91.98,50.04 v92.86,49.16
  Bottom 0.2: v82.81,55.77 82.73,55.85 81.23,55.85 79.91,57.18 79.64,57.18 PCB1.P$5 | v80.7,23.7 v77.44,20.44 | v95.32,46.69 v92.86,49.16
SDA  (via drill 0.35)
  Top 0.2: v83.43,58.41 85.9,58.41 89.42,54.89 104.49,54.89 R5.1 | v64.4,23.88 55.5,14.98 55.33,14.98 S1.P$3 | v75.68,38.85 75.68,45.64 81.14,51.1 82.11,51.1 | 82.11,51.1 85.55,51.1 85.81,50.83 85.81,50.48 BNO1.P$20 | 82.11,51.1 82.11,57.18 PCB1.P$3
  Bottom 0.2: v83.43,58.41 83.17,58.15 83.17,58.06 82.37,57.27 82.11,57.27 PCB1.P$3 | v64.4,23.88 64.4,27.57 v75.68,38.85
SONIC_ECHO
  Top 0.2: R21.1 26.87,87.92 26.87,82.28 25.81,81.23 25.81,68.63 34.62,59.82 36.3,59.82 PCB1.P$40 36.47,59.73 37.53,58.67 39.29,58.67 40,59.38 40,59.82 51.1,70.92 76.3,70.92 D3.C
SONIC_TRIG
  Top 0.2: R19.1 26.96,80.96 26.96,72.51 R20.1 27.05,72.42 38.85,60.61 38.85,59.82 PCB1.P$38

### Text on the board
tDocu: FTE CanSat